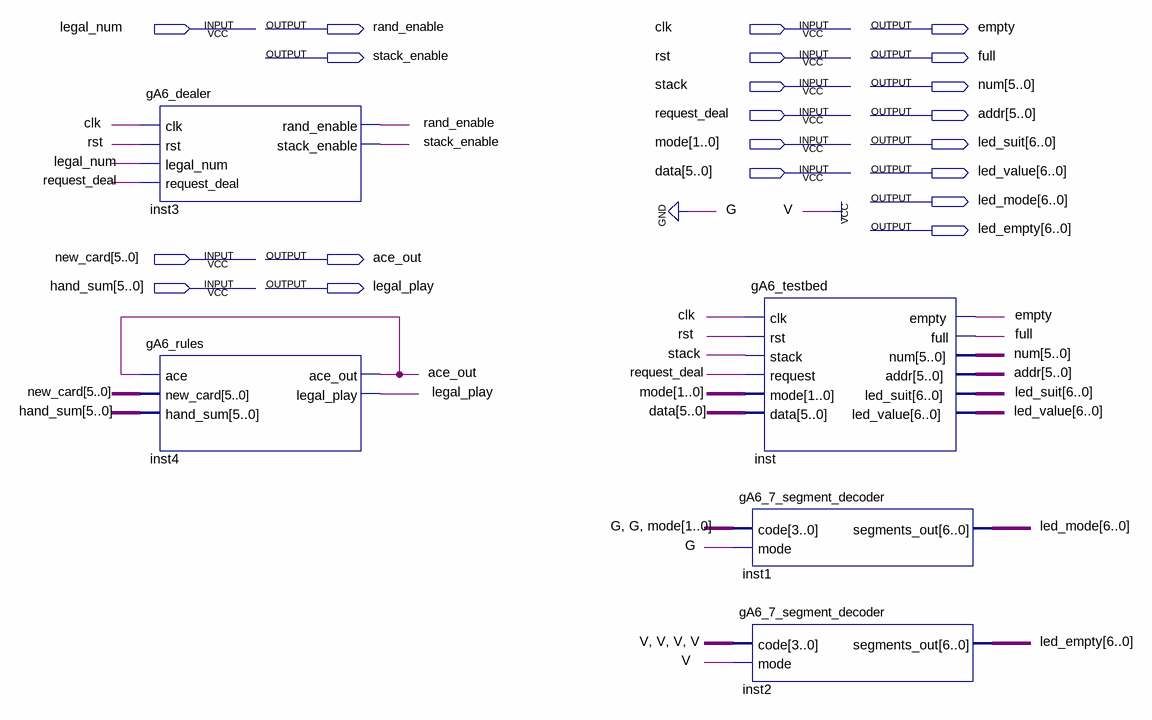
[diagram p0: schematic sheet]
// Quartus schematic gA6_lab4.bdf as structural Verilog: 5 symbols, 21 pins
module gA6_lab4 (
  input  legal_num,
  input  clk,
  input  rst,
  input  stack,
  input  request_deal,
  input  [1:0] mode,
  input  [5:0] data,
  input  [5:0] new_card,
  input  [5:0] hand_sum,
  output rand_enable,
  output empty,
  output stack_enable,
  output full,
  output [5:0] num,
  output [5:0] addr,
  output [6:0] led_suit,
  output [6:0] led_value,
  output [6:0] led_mode,
  output [6:0] led_empty,
  output ace_out,
  output legal_play
);

  gA6_dealer inst3 (
    .clk(clk), .rst(rst), .legal_num(legal_num), .request_deal(request_deal), .rand_enable(rand_enable),
    .stack_enable(stack_enable));
  gA6_rules inst4 (.ace(ace_out), .new_card(new_card), .hand_sum(hand_sum), .ace_out(ace_out), .legal_play(legal_play));
  gA6_testbed inst (
    .clk(clk), .rst(rst), .stack(stack), .request(request_deal), .mode(mode), .data(data), .empty(empty),
    .full(full), .num(num), .addr(addr), .led_suit(led_suit), .led_value(led_value));
  gA6_7_segment_decoder inst1 (.code({2'b00, mode}), .mode(1'b0), .segments_out(led_mode));
  gA6_7_segment_decoder inst2 (.code(4'b1111), .mode(1'b1), .segments_out(led_empty));
endmodule
